# EAGLE design LB_BIT_p2_COINBATTERY-v02(rev1) (EAGLE 6.6.0)
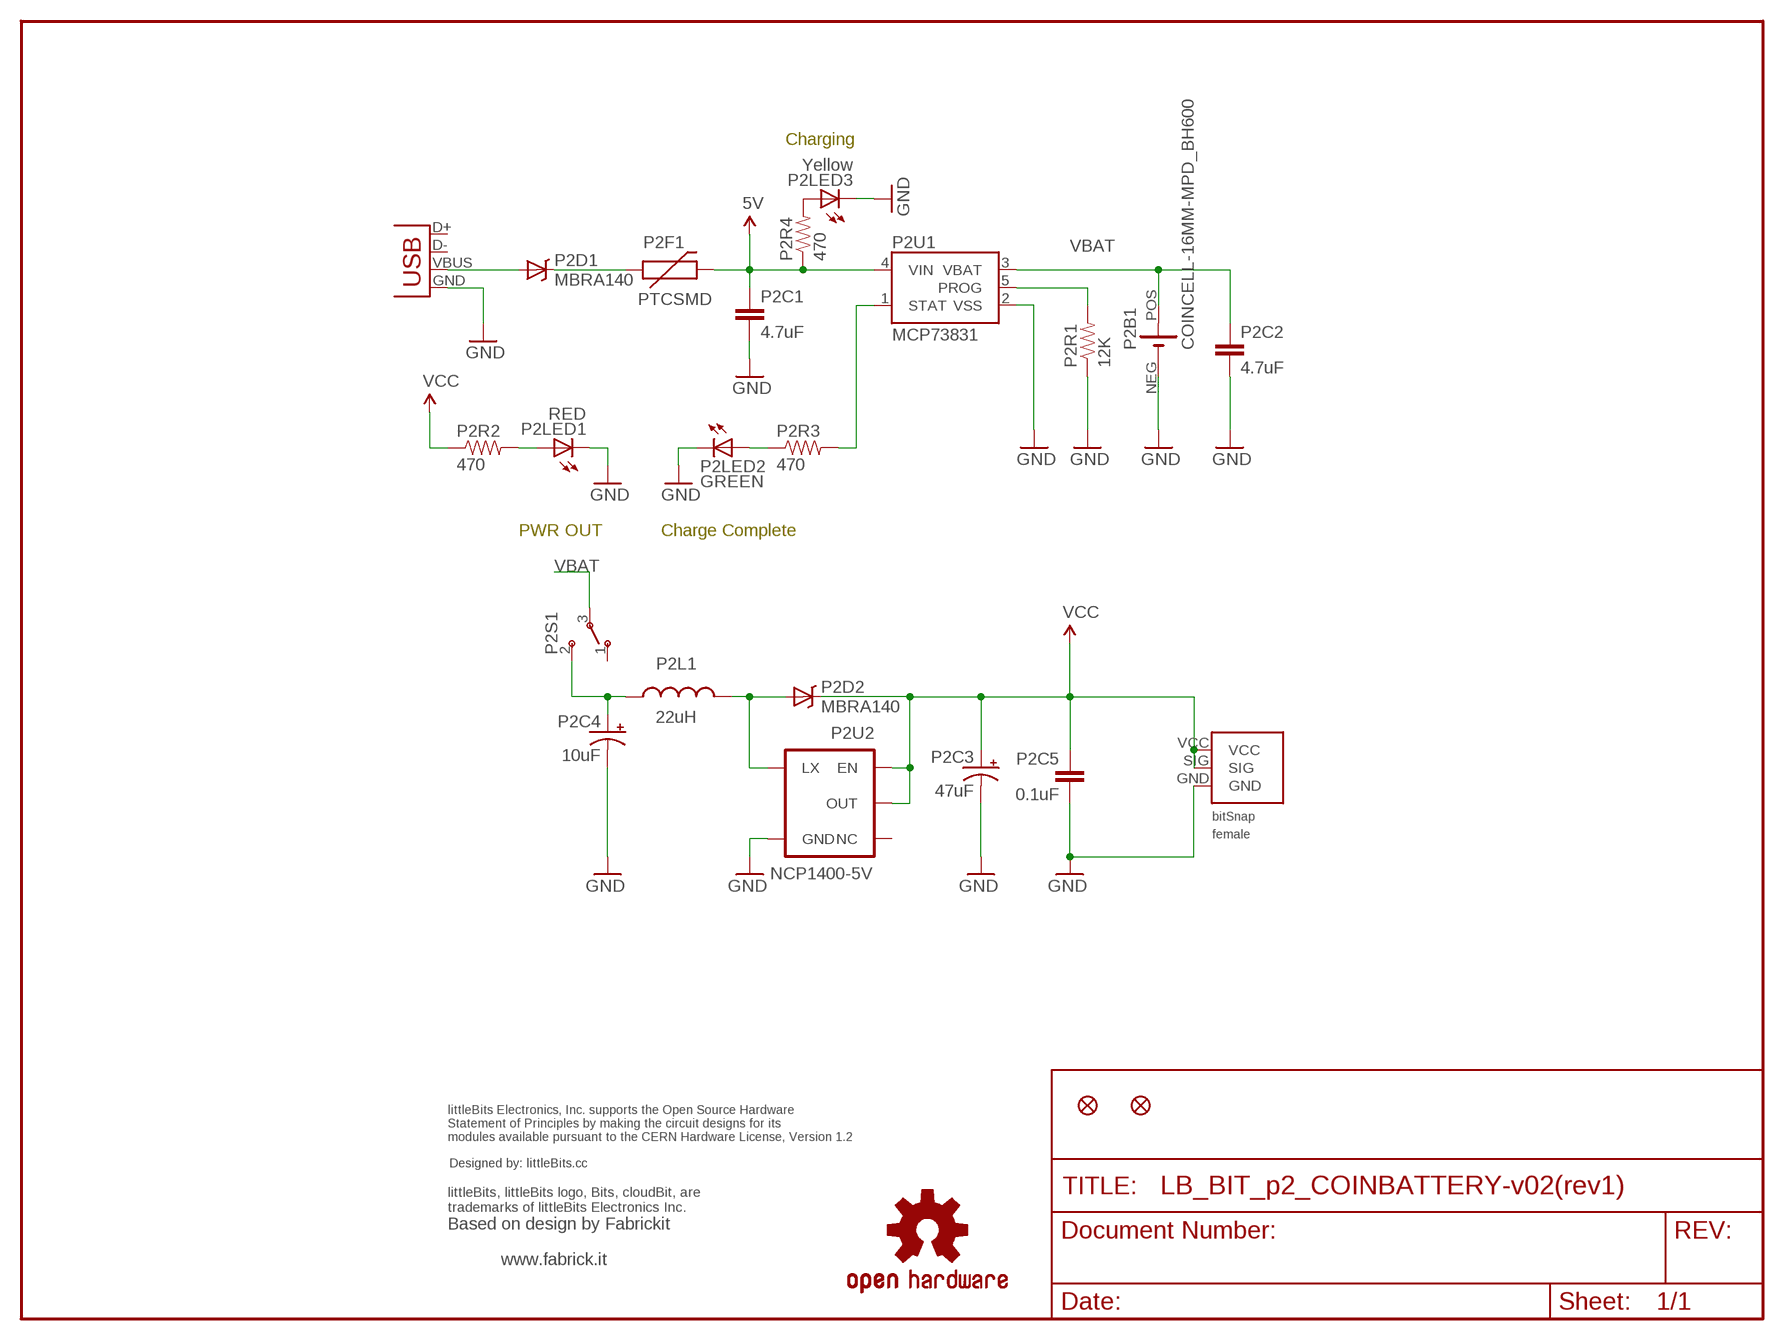
[diagram p0: schematic, sheet 1]

## Parts
JP1  FIDUCIAL1X2  [FIDUCIAL-1X2]
JP2  FIDUCIAL1X2  [FIDUCIAL-1X2]
P2B1  COINCELL-16MM-MPD_BH600  [COINCELL-16MM-MPD_BH600]
P2BSF  BITSNAP_FEMALE  [BITSNAP_FEMALE]
P2C1  4.7uF  CAP0603-CAP  [0603-CAP]
P2C2  4.7uF  CAP0603-CAP  [0603-CAP]
P2C3  47uF  CAP_POL3528  [EIA3528]
P2C4  10uF  CAP_POL1206  [EIA3216]
P2C5  0.1uF  CAP0603-CAP  [0603-CAP]
P2D1  MBRA140  DIODE-SCHOTTKY_  [SMA-DIODE]
P2D2  MBRA140  DIODE-SCHOTTKY_  [SMA-DIODE]
P2F1  PTCSMD  [PTC-1206]
P2L1  22uH  INDUCTOR-TAITO_YUDEN_NR6028T220M  [INDUCTOR-TAITO_YUDEN_NR6028T220M]
P2LED1  RED  LED1206  [LED-1206]
P2LED2  GREEN  LED1206  [LED-1206]
P2LED3  Yellow  LED1206  [LED-1206]
P2R1  12K  RESISTOR0603-RES  [0603-RES]
P2R2  470  RESISTOR0603-RES  [0603-RES]
P2R3  470  RESISTOR0603-RES  [0603-RES]
P2R4  470  RESISTOR0603-RES  [0603-RES]
P2S1  SWITCH-SMD-SLIDE-CSS1210TB  [COPAL_CSS1210TB]
P2U1  MCP73831  [SOT23-5]
P2U2  NCP1400-5V  V_REG_NCP1400SOT23-5  [SOT23-5]
P2X1  USB-MICROB  [USB-MICROB]
U$3  OSHWCREDIT  [OSHWCREDIT]
U$4  OSHW-LOGOL  [OSHW-LOGO-L]

## Nets
5V: P2C1.1 P2F1.2 P2R4.1 P2U1.4(VIN)
GND: P2B1.NEG(-) P2BSF.GND P2C1.2 P2C2.2 P2C3.C(-) P2C4.C(-) P2C5.2 P2LED1.C P2LED2.C P2LED3.C P2R1.1 P2U1.2(VSS) P2U2.4(GND) P2X1.GND
N$1: P2D1.A P2X1.VBUS
N$2: P2D1.C P2F1.1
N$3: P2LED3.A P2R4.2
N$4: P2LED1.A P2R2.2
N$5: P2LED2.A P2R3.1
N$16: P2D2.A P2L1.P$1 P2U2.5(LX)
PROG: P2R1.2 P2U1.5(PROG)
RAW: P2C4.A(+) P2L1.P$2 P2S1.2
STAT: P2R3.2 P2U1.1(STAT)
VBAT: P2B1.POS(+) P2C2.1 P2S1.3 P2U1.3(VBAT)
VCC: P2BSF.SIG P2BSF.VCC P2C3.A(+) P2C5.1 P2D2.C P2R2.1 P2U2.1(EN) P2U2.2(OUT)
Unconnected: P2S1.1 P2U2.3(NC) P2X1.D+ P2X1.D-

## Notes on the sheet
- Charging
- PWR OUT | Charge Complete
- Based on design by Fabrickit
- www.fabrick.it

## Library data of the parts
JP1 JP2 = SparkFun:FIDUCIAL: Fiducial Alignment Points Various fiducial points for machine vision alignment.
P2B1 = LITTLEBITS:COINCELL-16MM-MPD_BH600
P2BSF = bitSnap:BITSNAP_FEMALE
P2C1 P2C2 P2C5 = SparkFun:CAP: Capacitor Standard 0603 ceramic capacitor, and 0.1" leaded capacitor.
P2C3 P2C4 = SparkFun:CAP_POL: Capacitor Polarized These are standard SMD and PTH capacitors. Normally 10uF, 47uF, and 100uF in electrolytic and tantalum varieties. Always verify the external diameter of the through hole cap, it varies with capacity, voltage, and manufacturer. The EIA devices should be standard.
P2D1 P2D2 = SparkFun:DIODE-SCHOTTKY
P2F1 = SparkFun:PTC: Resettable Fuse PTC Resettable Fuse. Spark Fun Electronics SKU : COM-08357
P2L1 = LITTLEBITS:INDUCTOR-TAITO_YUDEN_NR6028T220M
P2LED1-P2LED3 = SparkFun:LED: LEDs Standard schematic elements and footprints for 5mm, 3mm, 1206, and 0603 sized LEDs. 5mm - Spark Fun Electronics SKU : COM-00529 (and others)
P2R1-P2R4 = SparkFun:RESISTOR: Resistor Basic schematic elements and footprints for 0603, 1206, and PTH 1/10th watt (small) resistors.
P2S1 = LITTLEBITS:SWITCH-SMD-SLIDE-CSS1210TB: Copal Electronics Compact Slide Switch CSS1210TB
P2U1 = SparkFun:MCP73831: Microchip's MCP73831 Miniature single cell, fully integrated Li-Ion, Li-polymer charge management controller http://ww1.microchip.com/downloads/en/DeviceDoc/21984a.pdf
P2U2 = SparkFun:V_REG_NCP1400: Switching step-up voltage regulator NCP1400 switiching regulator takes single cell AA and outputs 100mA at 3.3V or 5V with minimal number of external components.
P2X1 = SparkFun:USB: USB Connectors USB-B-PTH is fully proven SKU : PRT-00139 USB-miniB is fully proven SKU : PRT-00587 USB-A-PCB is untested. USB-A-H is throughly reviewed, but untested. Spark Fun Electronics SKU : PRT-00437 USB-B-SMT is throughly reviewed, but untested. Needs silkscreen touching up. USB-A-S has not been used/tested USB-MB-H has not been used/tested
U$3 = LITTLEBITS:OSHWCREDIT
U$4 = SparkFun_NEW:OSHW-LOGO: Open Source Hardware Logo This logo indicates the piece of hardware it is found on incorporates a OSHW license and/or adheres to the definition of open source hardware found here: http://freedomdefined.org/OSHW

## Net classes
0 Default: width 0.203 mm

## Board
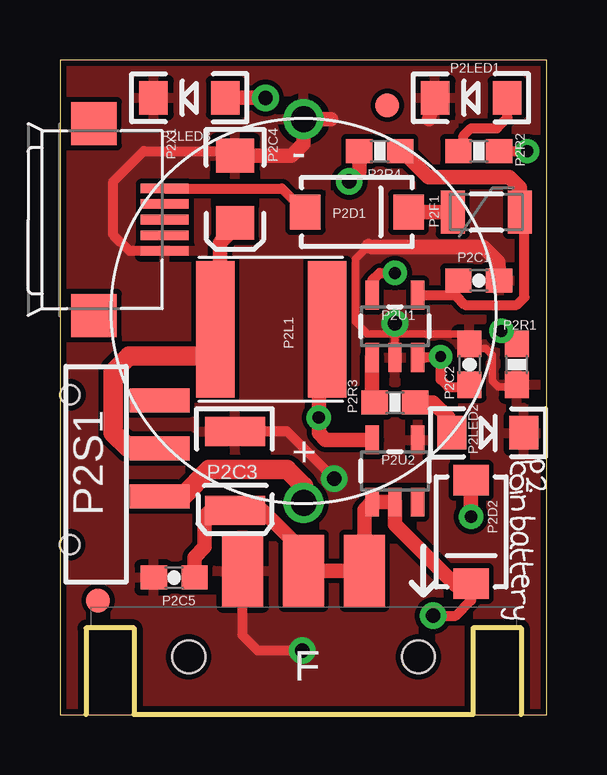
[diagram p1: board, top side]
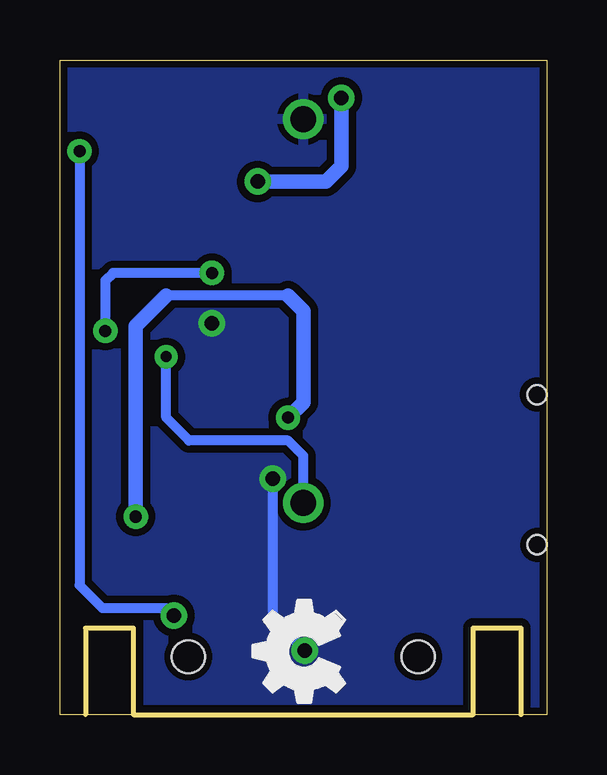
[diagram p2: board, bottom side, seen from below]

Size 20.31 x 27.3 mm. Coordinates in mm from the lower left corner, seen from the top.
Outline: 0,0 20.31,0 20.31,27.3 0,27.3 0,0
Copper layers (1*16): Top 0.035mm / dielectric 1.5mm / Bottom 0.035mm
Design rules "default": minimum track width 8mil, minimum drill 20mil, track to track 8mil, track to pad 8mil, pad to pad 8mil, via to via 8mil, smd to smd 8mil, copper to edge 10mil, drill to drill 8mil, minimum pad ring 12mil, minimum via ring 10mil, stop-mask expansion 4mil, vias tented up to drill 25mil, thermal gap 10mil

### Footprints (pad centres in the part's own frame; a part is rotated, then mirrored left to right if it is on the bottom)
FIDUCIAL-1X2 = smd 1 x 1: 1 0,0
COINCELL-16MM-MPD_BH600 = drill 1.067: NEG 0,8; POS 0,-8
BITSNAP_FEMALE = smd 1.7 x 3: GND 6.35,6; SIG 8.89,6; VCC 11.43,6 | hole 1.37: 13.68,2.41; 4.1,2.41
0603-CAP = smd 1.1 x 1: 1 -0.85,0; 2 0.85,0
EIA3528 = smd 1.2 x 2.5: A 1.65,0; C -1.65,0
EIA3216 = smd 1.4 x 1.6: A 1.4,0; C -1.4,0
SMA-DIODE = smd 1.27 x 1.47: A -2.15,0; C 2.15,0
PTC-1206 = smd 1 x 1.8: 1 -1.4,0; 2 1.4,0
INDUCTOR-TAITO_YUDEN_NR6028T220M = smd 1.6 x 5.7: P$1 0.025,0; P$2 4.7,0
LED-1206 = smd 1.2 x 1.4: A -1.5,0; C 1.5,0
0603-RES = smd 1.1 x 1: 1 -0.85,0; 2 0.85,0
COPAL_CSS1210TB = smd 1 x 2.5: 1 1.499,3.842; 2 3.504,3.842; 3 5.499,3.829 | hole 0.8: 1.262,0.102; 7.525,0.09
SOT23-5 = smd 0.55 x 1.2: 1 -0.95,-1.3; 2 0,-1.3; 3 0.95,-1.3; 4 0.95,1.3; 5 -0.95,1.3
USB-MICROB = smd 0.4 x 2: D+ 0,3.1; D- -0.65,3.1; GND 1.3,3.1; ID 0.65,3.1; VBUS -1.3,3.1 | smd 1.8 x 1.9: GND@2 -4,0.15; GND@3 4,0.15

### Placement (x,y rotation side)
E$1  [O_SMALL]  18.35,10.54 270 top
E$2  [I_SMALL]  18.35,9.84 270 top
E$3  [N_SMALL]  18.61,9.46 270 top
E$4  [B_SMALL]  18.41,8.83 270 top
E$5  [A_BATTERY]  18.29,8.06 270 top
E$6  [T_SMALL]  18.61,6.86 270 top
E$7  [T_SMALL]  18.61,6.29 270 top
E$8  [E_SMALL]  18.54,6.35 270 top
E$9  [R_SMALL]  18.54,5.65 270 top
E$10  [Y_SMALL]  18.48,5.08 270 top
E$11  [P_SMALL]  19.18,11.11 270 top
E$12  [2_SMALL]  19.24,9.84 270 top
JP1  1.59,4.76 0 top
JP2  13.65,25.4 0 top
P2B1  10.16,16.83 0 top
P2BSF  1.27,0 0 top
P2C1  17.46,18.1 0 top
P2C2  17.08,14.61 90 top
P2C3  7.3,10.16 270 top
P2C4  7.3,21.91 270 top
P2C5  4.76,5.71 180 top
P2D1  12.38,20.95 0 top
P2D2  17.14,7.62 270 top
P2F1  17.78,20.95 0 top
P2L1  11.18,16.07 180 top
P2LED1  17.14,25.72 180 top
P2LED2  17.84,11.75 0 top
P2LED3  5.4,25.72 180 top
P2R1  19.05,14.61 90 top
P2R2  17.46,23.5 180 top
P2R3  13.97,13.02 180 top
P2R4  13.34,23.5 180 top
P2S1  0.32,14.61 270 top
P2U1  13.97,16.19 0 top
P2U2  13.97,10.16 0 top
P2X1  1.27,20.64 270 top
U$1  [C_SMALL]  18.16,10.92 270 top
U$3  -16.83,-27.94 0 top  (outside the outline)
U$4  -13.65,-11.11 0 top  (outside the outline)
U$7  [OSHW_FILLX150_NOTEXT]  8.45,-0.32 0 top

### Tracks (layer width: path | path; a pad name or v marks a point on that pad's centre or on a via)
5V
  Top 0.406: 19.05,21.09 19.05,20.64 19.37,20.32 19.37,17.4 19.05,17.08 16.89,17.08 16.51,17.46 | 16.51,17.46 16.51,18 P2C1.1 | P2U1.4 16.48,17.49 16.51,17.46
  Top 0.61: 19.05,21.09 P2F1.2 19.18,21.97 18.73,22.42 15.37,22.42 14.29,23.5 P2R4.1
GND  (via drill 0.6)
  Top 0.305: 19.04,13.65 18.29,13.65 18.03,13.91 18.03,14.99 17.77,15.26 17.13,15.26 17.14,15.24 | 13.97,15.88 P2U1.2 | 17.14,15.24 P2C2.2 | 17.14,15.24 17.14,15.56 16.83,15.88 13.97,15.88 | 13.97,15.88 12.83,15.88 12.32,16.38 12.32,18.99 12.86,19.53
  Top 0.406: P2X1.GND 2.89,19.34 2.22,20 2.22,22.23 3.49,23.5 7.43,23.5 P2C4.C | P2C2.2 17.13,15.26 | P2C3.C 9.46,11.81 v11.43,9.84 | v10.1,2.67 8.26,2.67 7.62,3.3 P2BSF.GND
  Top 0.61: P2C4.C 9.08,23.3 9.65,23.3 10.16,23.81 10.16,24.77 | 10.16,24.7 P2B1.NEG 11.3,24.83 | 15.38,24.83 P2LED1.C | 12.86,19.53 13.02,19.49 17.65,19.49 18.29,18.86 18.29,18.88 P2C1.2 | 19.04,13.65 19.05,13.97 P2R1.1 18.96,13.55
  Bottom 0.406: v11.43,9.84 11.43,4 v10.1,2.67
  other vias: 13.97,16.32
  pour Top: 0.32,26.99 20,26.99 20,0.32 0.32,0.32
  pour Bottom (isolate 0.305): 0.32,26.99 20,26.99 20,0.32 0.32,0.32
N$1
  Top 0.406: P2X1.VBUS 9.25,21.94 P2D1.A
N$2
  Top 0.61: P2D1.C P2F1.1
N$3  (via drill 0.6)
  Top 0.61: P2R4.2 12.48,22.64 v12.06,22.23 | v8.57,25.72 P2LED3.A
  Bottom 0.61: v12.06,22.23 9.21,22.23 8.57,22.86 v8.57,25.72
N$4
  Top 0.406: P2LED1.A 18.66,24.88 18.22,24.45 17.14,24.45 16.83,24.13 16.83,23.83 P2R2.2
N$5
  Top 0.61: 16.19,12.06 P2LED2.A 16.19,11.9 16.19,12.38 15.56,13.02 P2R3.1
N$16  (via drill 0.51)
  Top 0.61: P2U2.5 11.08,11.46 10.79,11.75 v10.79,12.38 10.79,15.54 P2L1.P$1 | v17.14,8.26 P2D2.A
  Bottom 0.406: 10.79,17.46 15.88,17.46
  Bottom 0.61: v17.14,8.26 17.14,16.19 15.88,17.46 | 10.79,17.46 10.16,16.83 10.16,13.02 v10.79,12.38
PROG  (via drill 0.5, 0.51)
  Top 0.406: P2R1.2 19.05,15.56 18.8,15.56 v18.41,16 | v13.97,18.41 13.34,18.41 13.02,18.1 P2U1.5
  Bottom 0.406: v18.41,16 18.41,18.1 18.1,18.41 v13.97,18.41
RAW
  Top 0.406: 6.67,15.57 6.67,15.56
  Top 0.61: 6.57,15.48 P2L1.P$2 6.67,15.57 6.67,19.68 7.49,20.51 P2C4.A
  Top 0.813: 6.49,15.56 6.57,15.48 | P2S1.2 4.15,11.11 2.86,11.11 2.22,11.75 2.22,14.29 2.89,14.95 6.67,14.95 6.67,15.56 6.35,15.56
STAT
  Top 0.61: P2U1.1 13.02,13.35 P2R3.2
VBAT  (via drill 0.46)
  Top 0.406: 15.27,14.89 P2U1.3 15.85,14.89 v15.88,14.92 15.88,13.97 16.19,13.65 16.98,13.65 P2C2.1
  Top 0.813: P2B1.POS 10.16,9.53 9.46,10.22 6.22,10.22 5.11,9.11 P2S1.3
  Bottom 0.406: v15.88,14.92 15.88,12.38 14.92,11.43 10.79,11.43 10.16,10.79 P2B1.POS
VCC  (via drill 0.5, 0.6)
  Top 0.406: P2R2.1 v19.49,23.5 | v15.56,4.13 16.51,4.13 17.14,4.76 P2D2.C
  Top 0.61: P2D2.C 17.07,5.4 16.51,5.4 13.97,7.94 P2U2.2 P2U2.1 12.7,8.54 P2BSF.VCC P2BSF.SIG 9.97,6.99 8.44,8.51 P2C3.A 7.56,8.57 6.35,8.57 6.03,8.26 6.03,6.99 5.61,6.57 P2C5.1
  Bottom 0.406: v19.49,23.5 19.49,5.4 18.54,4.45 15.88,4.45 v15.56,4.13

### Text on the board
Reference: Based on design by Fabrickit | www.fabrick.it